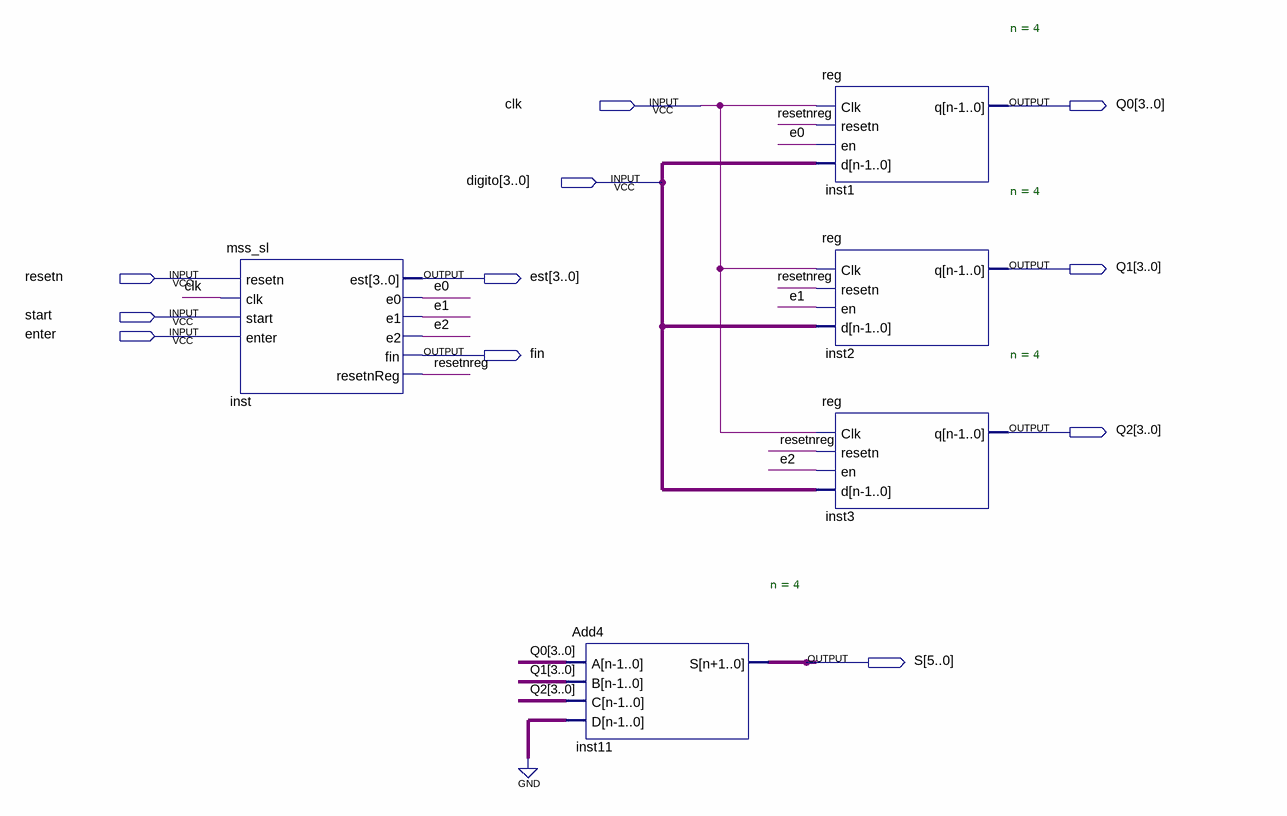
[diagram p0: schematic sheet]
// Quartus schematic PROYECTO.bdf as structural Verilog: 5 symbols, 11 pins
module PROYECTO (
  input  clk,
  input  [3:0] digito,
  input  resetn,
  input  start,
  input  enter,
  output [3:0] Q0,
  output [3:0] Q1,
  output [3:0] est,
  output fin,
  output [3:0] Q2,
  output [5:0] S
);

  wire e0, e1, e2, resetnreg;

  mss_sl inst (
    .resetn(resetn), .clk(clk), .start(start), .enter(enter), .est(est), .e0(e0), .e1(e1), .e2(e2),
    .fin(fin), .resetnReg(resetnreg));
  Add4 #(.n(4)) inst11 (.A(Q0), .B(Q1), .C(Q2), .D(4'b0000), .S(S));
  \reg  #(.n(4)) inst1 (.Clk(clk), .resetn(resetnreg), .en(e0), .d(digito), .q(Q0));
  \reg  #(.n(4)) inst2 (.Clk(clk), .resetn(resetnreg), .en(e1), .d(digito), .q(Q1));
  \reg  #(.n(4)) inst3 (.Clk(clk), .resetn(resetnreg), .en(e2), .d(digito), .q(Q2));
endmodule
